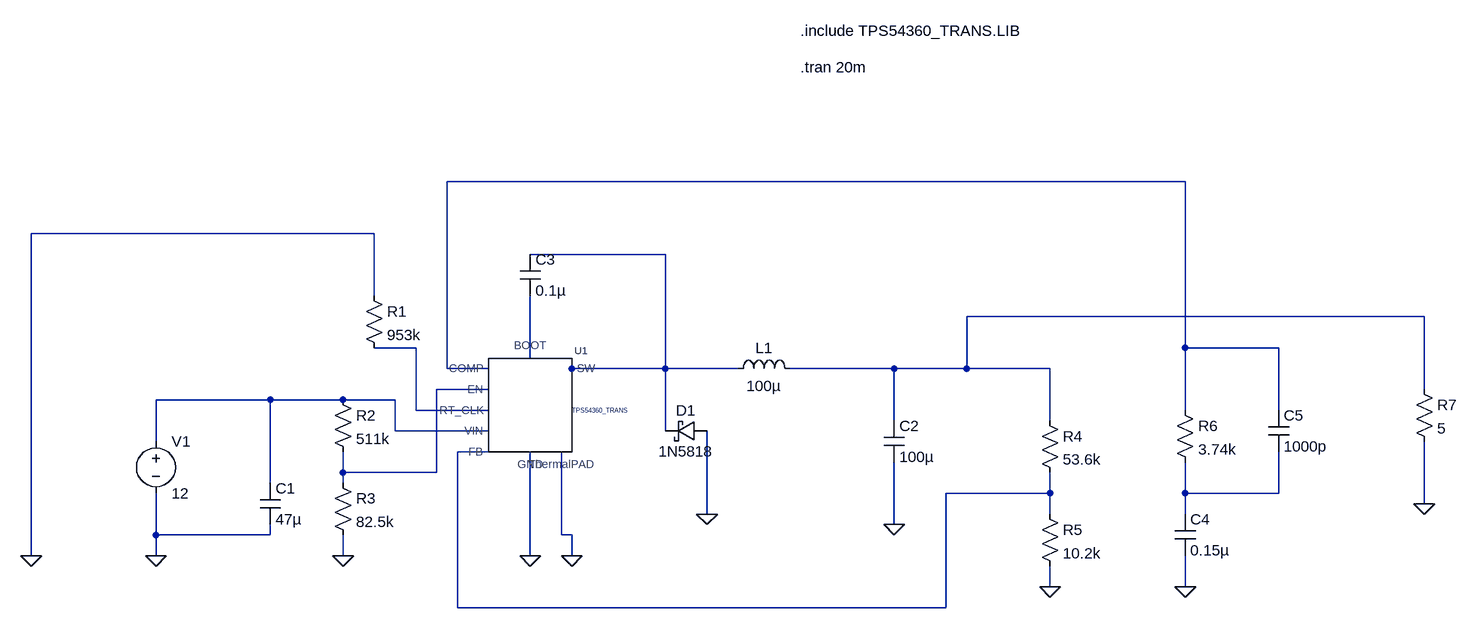
[diagram p0: schematic Draft1.asc]
Draft1.asc, the LTspice schematic file:
Version 4.1
SHEET 1 1864 680
WIRE 1440 -368 304 -368
WIRE 192 -288 -336 -288
WIRE 640 -256 432 -256
WIRE 192 -192 192 -288
WIRE 1808 -160 1104 -160
WIRE 256 -112 192 -112
WIRE 1440 -112 1440 -368
WIRE 1584 -112 1440 -112
WIRE 432 -96 432 -192
WIRE 304 -80 304 -368
WIRE 368 -80 304 -80
WIRE 640 -80 640 -256
WIRE 640 -80 496 -80
WIRE 752 -80 640 -80
WIRE 992 -80 832 -80
WIRE 1104 -80 1104 -160
WIRE 1104 -80 992 -80
WIRE 1232 -80 1104 -80
WIRE 368 -48 288 -48
WIRE 1808 -48 1808 -160
WIRE 32 -32 -144 -32
WIRE 144 -32 32 -32
WIRE 224 -32 144 -32
WIRE 256 -16 256 -112
WIRE 368 -16 256 -16
WIRE 1440 -16 1440 -112
WIRE 1584 -16 1584 -112
WIRE 992 0 992 -80
WIRE 1232 0 1232 -80
WIRE 224 16 224 -32
WIRE 368 16 224 16
WIRE 496 16 496 -80
WIRE 640 16 640 -80
WIRE -144 32 -144 -32
WIRE 368 48 320 48
WIRE 144 80 144 48
WIRE 288 80 288 -48
WIRE 288 80 144 80
WIRE 32 96 32 -32
WIRE 144 96 144 80
WIRE 1232 112 1232 80
WIRE 1232 112 1072 112
WIRE 1440 112 1440 64
WIRE 1584 112 1584 48
WIRE 1584 112 1440 112
WIRE 1808 128 1808 32
WIRE 704 144 704 16
WIRE 1232 144 1232 112
WIRE 1440 144 1440 112
WIRE 992 160 992 64
WIRE -144 176 -144 112
WIRE 32 176 32 160
WIRE 32 176 -144 176
WIRE 480 176 480 48
WIRE 496 176 480 176
WIRE -336 208 -336 -288
WIRE -144 208 -144 176
WIRE 144 208 144 176
WIRE 432 208 432 48
WIRE 496 208 496 176
WIRE 1232 256 1232 224
WIRE 1440 256 1440 208
WIRE 320 288 320 48
WIRE 1072 288 1072 112
WIRE 1072 288 320 288
FLAG -144 208 0
FLAG 432 208 0
FLAG 496 208 0
FLAG 992 160 0
FLAG 704 144 0
FLAG -336 208 0
FLAG 144 208 0
FLAG 1232 256 0
FLAG 1440 256 0
FLAG 1808 128 0
SYMBOL voltage -144 16 R0
WINDOW 123 0 0 Left 0
WINDOW 39 0 0 Left 0
SYMATTR InstName V1
SYMATTR Value 12
SYMBOL cap 16 96 R0
SYMATTR InstName C1
SYMATTR Value 47µ
SYMBOL TPS54360_TRANS 432 -32 R0
SYMATTR Value TPS54360_TRANS
SYMATTR InstName U1
SYMBOL ind 736 -64 R270
WINDOW 0 32 56 VTop 2
WINDOW 3 5 56 VBottom 2
SYMATTR InstName L1
SYMATTR Value 100µ
SYMATTR SpiceLine Rser=1m
SYMBOL cap 976 0 R0
SYMATTR InstName C2
SYMATTR Value 100µ
SYMBOL schottky 704 0 R90
WINDOW 0 0 32 VBottom 2
WINDOW 3 32 32 VTop 2
SYMATTR InstName D1
SYMATTR Value 1N5818
SYMATTR Description Diode
SYMATTR Type diode
SYMBOL cap 416 -256 R0
SYMATTR InstName C3
SYMATTR Value 0.1µ
SYMBOL res 176 -208 R0
SYMATTR InstName R1
SYMATTR Value 953k
SYMBOL res 128 -48 R0
SYMATTR InstName R2
SYMATTR Value 511k
SYMBOL res 128 80 R0
SYMATTR InstName R3
SYMATTR Value 82.5k
SYMBOL res 1216 -16 R0
SYMATTR InstName R4
SYMATTR Value 53.6k
SYMBOL res 1216 128 R0
SYMATTR InstName R5
SYMATTR Value 10.2k
SYMBOL res 1424 -32 R0
SYMATTR InstName R6
SYMATTR Value 3.74k
SYMBOL cap 1424 144 R0
SYMATTR InstName C4
SYMATTR Value 0.15µ
SYMBOL cap 1568 -16 R0
SYMATTR InstName C5
SYMATTR Value 1000p
SYMBOL res 1792 -64 R0
SYMATTR InstName R7
SYMATTR Value 5
TEXT 848 -600 Left 2 !.include TPS54360_TRANS.LIB
TEXT 848 -544 Left 2 !.tran 20m

The netlist it stands for:
* Draft1.asc
V1 N007 0 12
C1 N007 0 47µ
X§U1 N005 N001 N006 0 N002 N004 N007 N008 0 TPS54360_TRANS  ; pins BOOT COMP EN GND SW RT_CLK VIN FB ThermalPAD
L1 N002 N003 100µ Rser=1m
C2 N003 0 100µ
D1 0 N002 1N5818
C3 N002 N005 0.1µ
R1 0 N004 953k
R2 N007 N006 511k
R3 N006 0 82.5k
R4 N003 N008 53.6k
R5 N008 0 10.2k
R6 N001 N009 3.74k
C4 N009 0 0.15µ
C5 N001 N009 1000p
R7 N003 0 5
.model D D
.lib standard.dio
.include TPS54360_TRANS.LIB
.tran 20m
.backanno
.end